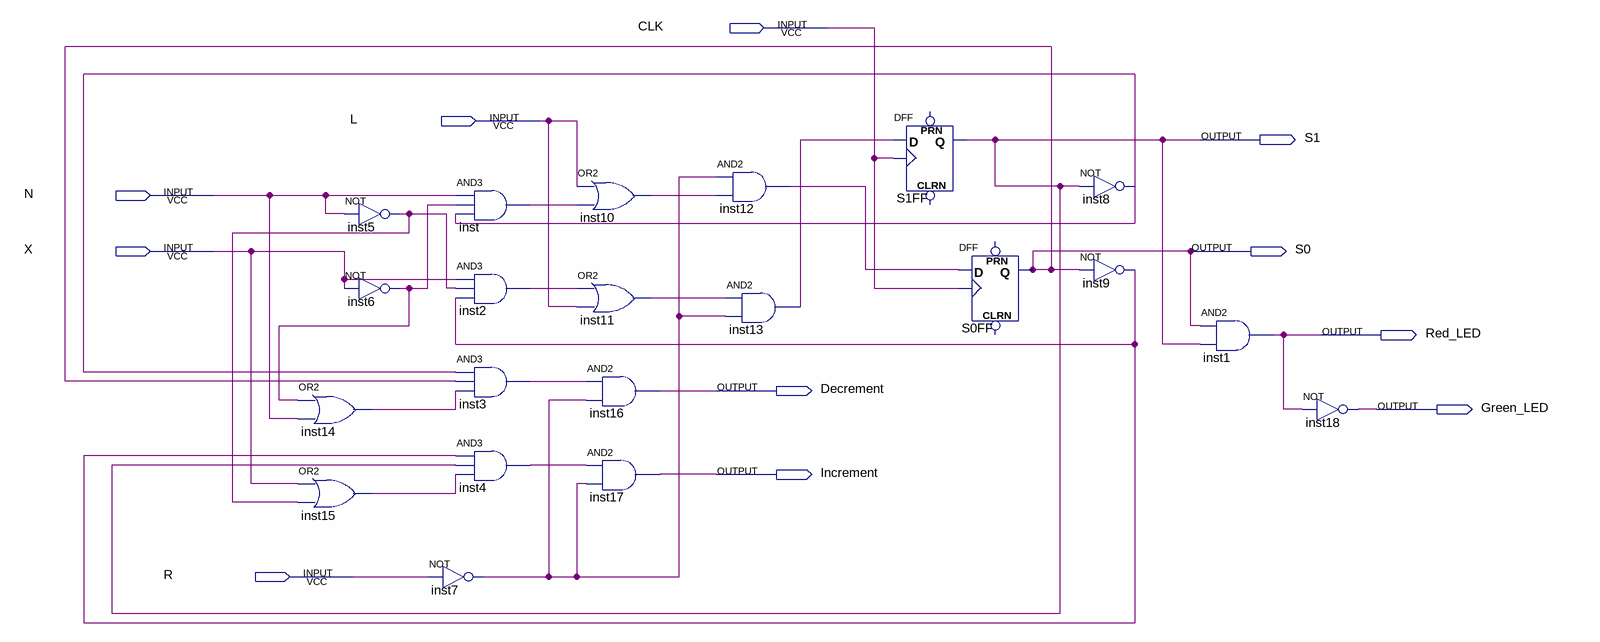
[diagram p0: schematic sheet]
// Quartus schematic FSM.bdf as structural Verilog: 21 symbols, 11 pins
module FSM (
  input  CLK,
  input  L,
  input  N,
  input  X,
  input  R,
  output S1,
  output S0,
  output Red_LED,
  output Decrement,
  output Green_LED,
  output Increment
);

  wire inst2_out, inst3_out, inst4_out, inst5_out, inst6_out, inst7_out, inst8_out, inst9_out, inst10_out,
       inst11_out, inst12_out, inst13_out, inst14_out, inst15_out, inst_out;

  not inst5 (inst5_out, N);
  not inst6 (inst6_out, X);
  or inst14 (inst14_out, inst6_out, N);
  or inst15 (inst15_out, X, inst5_out);
  not inst7 (inst7_out, R);
  and inst (inst_out, N, inst6_out, inst8_out);
  and inst2 (inst2_out, X, inst5_out, inst9_out);
  and inst3 (inst3_out, inst8_out, S0, inst14_out);
  and inst4 (inst4_out, inst9_out, S1, inst15_out);
  or inst10 (inst10_out, L, inst_out);
  or inst11 (inst11_out, inst2_out, L);
  and inst16 (Decrement, inst3_out, inst7_out);
  and inst17 (Increment, inst4_out, inst7_out);
  and inst12 (inst12_out, inst7_out, inst10_out);
  and inst13 (inst13_out, inst11_out, inst7_out);
  DFF S1FF (.CLK(CLK), .D(inst13_out), .Q(S1));  // open: CLRN, PRN
  DFF S0FF (.CLK(CLK), .D(inst12_out), .Q(S0));  // open: CLRN, PRN
  not inst8 (inst8_out, S1);
  not inst9 (inst9_out, S0);
  and inst1 (Red_LED, S0, S1);
  not inst18 (Green_LED, Red_LED);
endmodule
